# Altium schematic sheet DDR3_Termination.SchDoc
size A3
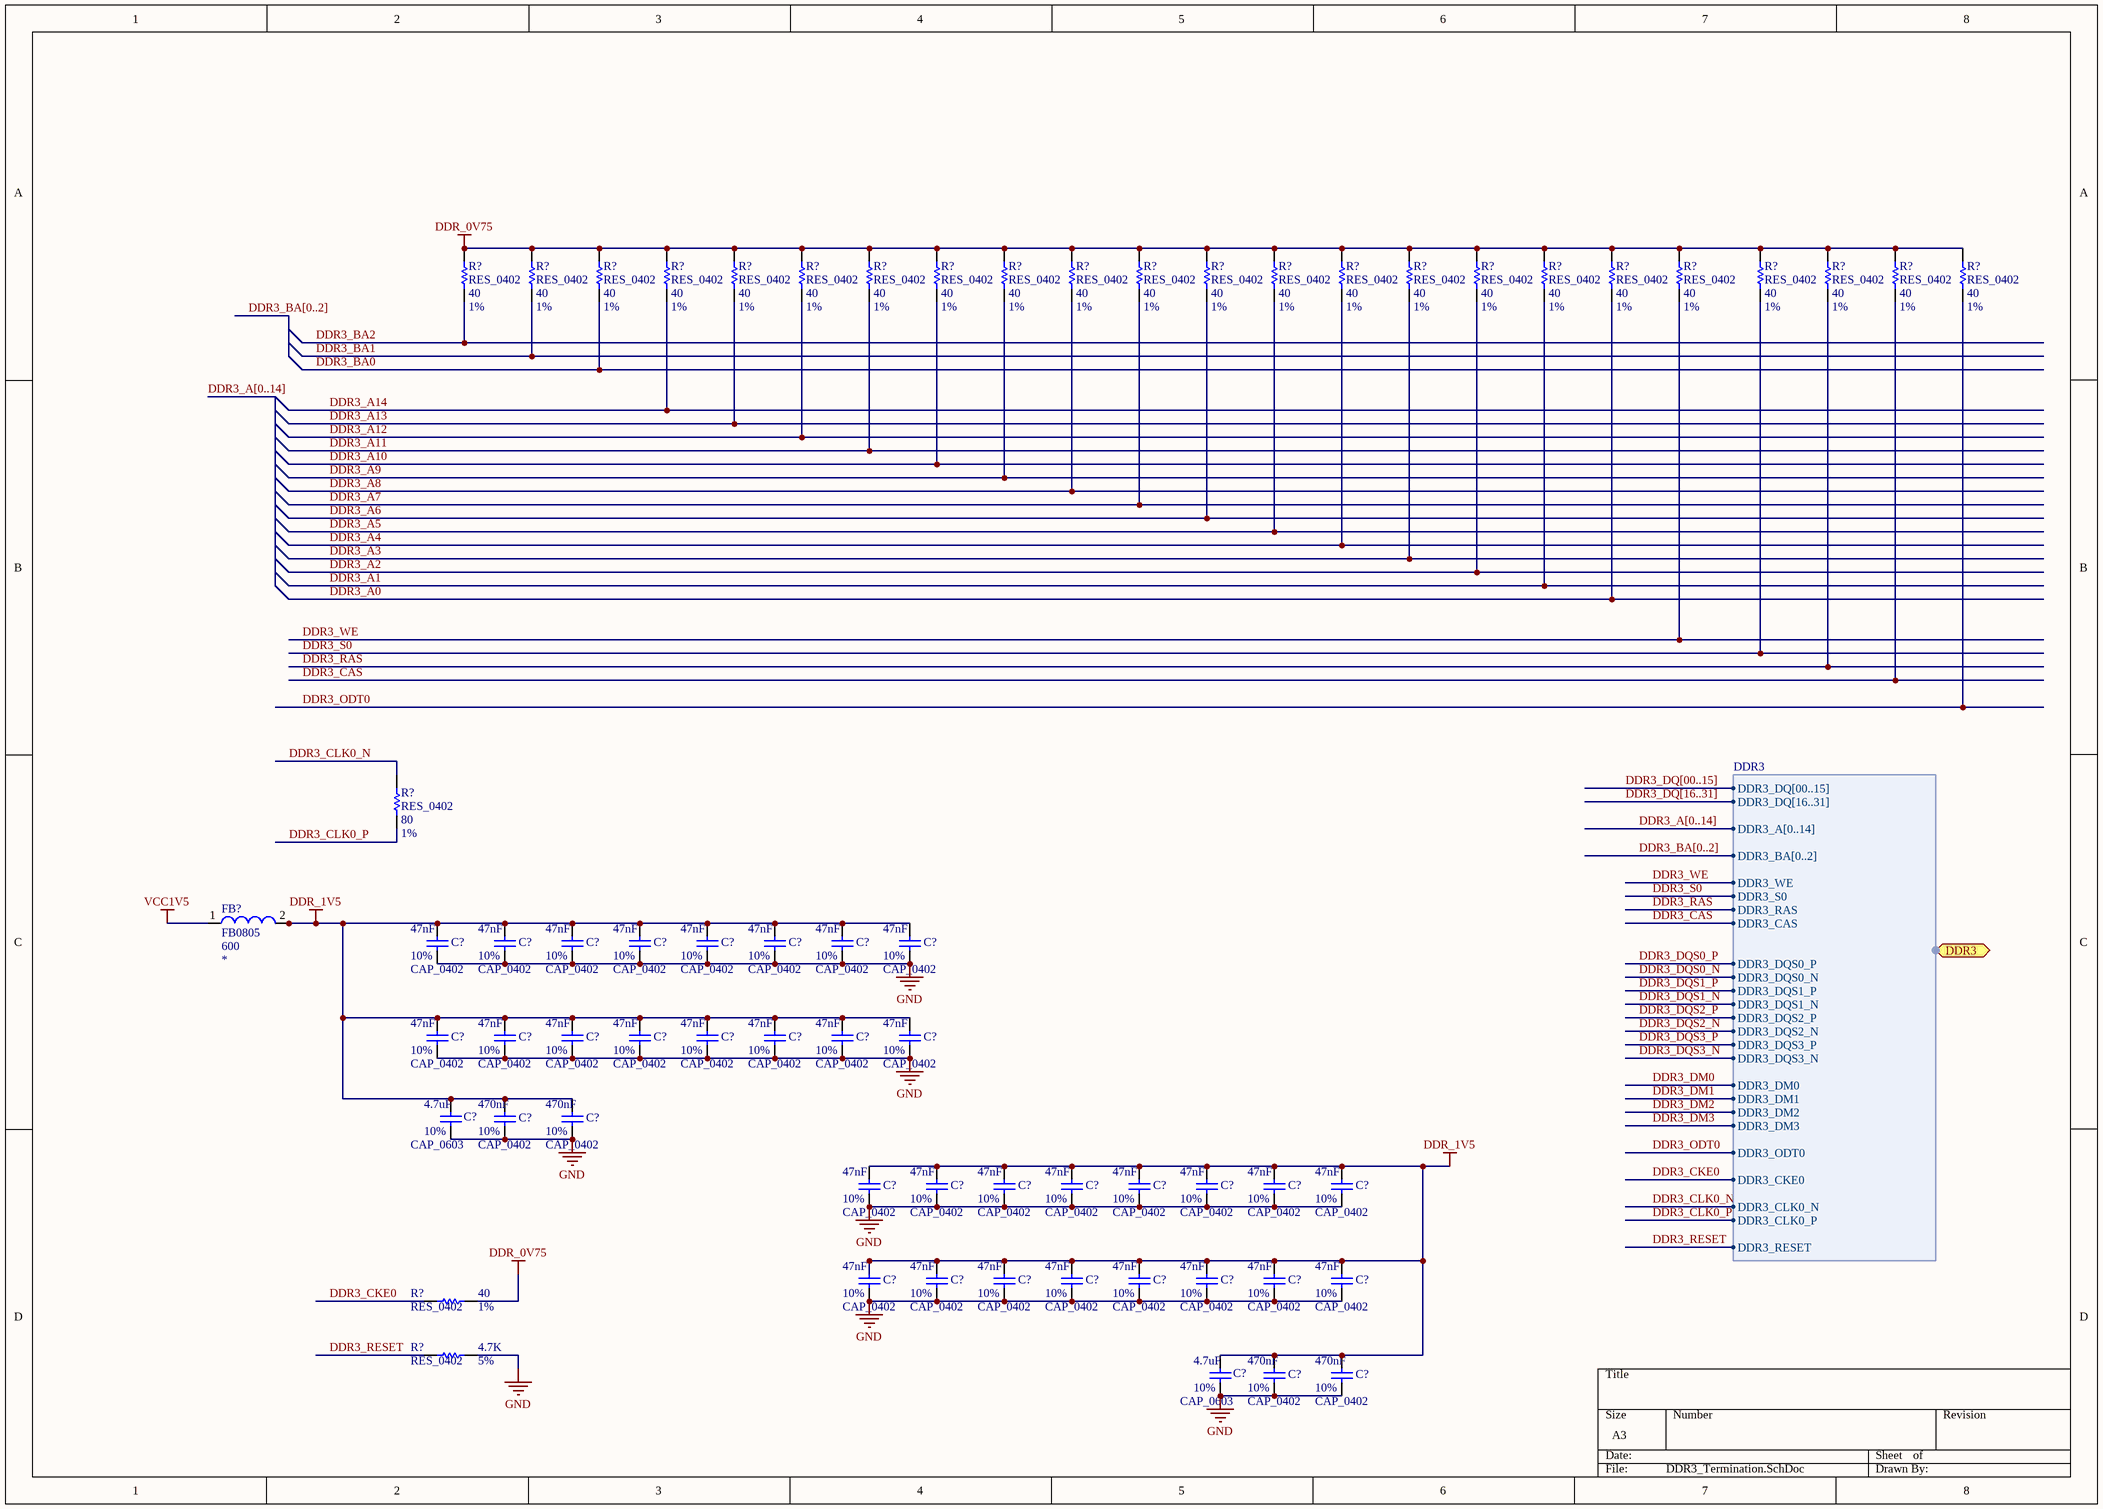
[diagram p0: DDR3_Termination.SchDoc]

## Parts
(Parts that share a designator on the sheet are numbered #1, #2 ... from top to bottom, then left to right.)
C?#1  CAP_0402  value 47nF  Tolerance: 10%  [CAPC0402(1005)60_N]
C?#2  CAP_0402  value 47nF  Tolerance: 10%  [CAPC0402(1005)60_N]
C?#3  CAP_0402  value 47nF  Tolerance: 10%  [CAPC0402(1005)60_N]
C?#4  CAP_0402  value 47nF  Tolerance: 10%  [CAPC0402(1005)60_N]
C?#5  CAP_0402  value 47nF  Tolerance: 10%  [CAPC0402(1005)60_N]
C?#6  CAP_0402  value 47nF  Tolerance: 10%  [CAPC0402(1005)60_N]
C?#7  CAP_0402  value 47nF  Tolerance: 10%  [CAPC0402(1005)60_N]
C?#8  CAP_0402  value 47nF  Tolerance: 10%  [CAPC0402(1005)60_N]
C?#9  CAP_0402  value 47nF  Tolerance: 10%  [CAPC0402(1005)60_N]
C?#10  CAP_0402  value 47nF  Tolerance: 10%  [CAPC0402(1005)60_N]
C?#11  CAP_0402  value 47nF  Tolerance: 10%  [CAPC0402(1005)60_N]
C?#12  CAP_0402  value 47nF  Tolerance: 10%  [CAPC0402(1005)60_N]
C?#13  CAP_0402  value 47nF  Tolerance: 10%  [CAPC0402(1005)60_N]
C?#14  CAP_0402  value 47nF  Tolerance: 10%  [CAPC0402(1005)60_N]
C?#15  CAP_0402  value 47nF  Tolerance: 10%  [CAPC0402(1005)60_N]
C?#16  CAP_0402  value 47nF  Tolerance: 10%  [CAPC0402(1005)60_N]
C?#17  CAP_0603  value 4.7uF  Tolerance: 10%  [CAPC0603(1608)100_N]
C?#18  CAP_0402  value 470nF  Tolerance: 10%  [CAPC0402(1005)60_N]
C?#19  CAP_0402  value 470nF  Tolerance: 10%  [CAPC0402(1005)60_N]
C?#20  CAP_0402  value 47nF  Tolerance: 10%  [CAPC0402(1005)60_N]
C?#21  CAP_0402  value 47nF  Tolerance: 10%  [CAPC0402(1005)60_N]
C?#22  CAP_0402  value 47nF  Tolerance: 10%  [CAPC0402(1005)60_N]
C?#23  CAP_0402  value 47nF  Tolerance: 10%  [CAPC0402(1005)60_N]
C?#24  CAP_0402  value 47nF  Tolerance: 10%  [CAPC0402(1005)60_N]
C?#25  CAP_0402  value 47nF  Tolerance: 10%  [CAPC0402(1005)60_N]
C?#26  CAP_0402  value 47nF  Tolerance: 10%  [CAPC0402(1005)60_N]
C?#27  CAP_0402  value 47nF  Tolerance: 10%  [CAPC0402(1005)60_N]
C?#28  CAP_0402  value 47nF  Tolerance: 10%  [CAPC0402(1005)60_N]
C?#29  CAP_0402  value 47nF  Tolerance: 10%  [CAPC0402(1005)60_N]
C?#30  CAP_0402  value 47nF  Tolerance: 10%  [CAPC0402(1005)60_N]
C?#31  CAP_0402  value 47nF  Tolerance: 10%  [CAPC0402(1005)60_N]
C?#32  CAP_0402  value 47nF  Tolerance: 10%  [CAPC0402(1005)60_N]
C?#33  CAP_0402  value 47nF  Tolerance: 10%  [CAPC0402(1005)60_N]
C?#34  CAP_0402  value 47nF  Tolerance: 10%  [CAPC0402(1005)60_N]
C?#35  CAP_0402  value 47nF  Tolerance: 10%  [CAPC0402(1005)60_N]
C?#36  CAP_0603  value 4.7uF  Tolerance: 10%  [CAPC0603(1608)100_N]
C?#37  CAP_0402  value 470nF  Tolerance: 10%  [CAPC0402(1005)60_N]
C?#38  CAP_0402  value 470nF  Tolerance: 10%  [CAPC0402(1005)60_N]
FB?  FB0805  Resistance: 600  [FerriteBead0805_WurthElectronik]
R?#1  RES_0402  value 40  Tolerance: 1%  [RESC0402(1005)_N]
R?#2  RES_0402  value 40  Tolerance: 1%  [RESC0402(1005)_N]
R?#3  RES_0402  value 40  Tolerance: 1%  [RESC0402(1005)_N]
R?#4  RES_0402  value 40  Tolerance: 1%  [RESC0402(1005)_N]
R?#5  RES_0402  value 40  Tolerance: 1%  [RESC0402(1005)_N]
R?#6  RES_0402  value 40  Tolerance: 1%  [RESC0402(1005)_N]
R?#7  RES_0402  value 40  Tolerance: 1%  [RESC0402(1005)_N]
R?#8  RES_0402  value 40  Tolerance: 1%  [RESC0402(1005)_N]
R?#9  RES_0402  value 40  Tolerance: 1%  [RESC0402(1005)_N]
R?#10  RES_0402  value 40  Tolerance: 1%  [RESC0402(1005)_N]
R?#11  RES_0402  value 40  Tolerance: 1%  [RESC0402(1005)_N]
R?#12  RES_0402  value 40  Tolerance: 1%  [RESC0402(1005)_N]
R?#13  RES_0402  value 40  Tolerance: 1%  [RESC0402(1005)_N]
R?#14  RES_0402  value 40  Tolerance: 1%  [RESC0402(1005)_N]
R?#15  RES_0402  value 40  Tolerance: 1%  [RESC0402(1005)_N]
R?#16  RES_0402  value 40  Tolerance: 1%  [RESC0402(1005)_N]
R?#17  RES_0402  value 40  Tolerance: 1%  [RESC0402(1005)_N]
R?#18  RES_0402  value 40  Tolerance: 1%  [RESC0402(1005)_N]
R?#19  RES_0402  value 40  Tolerance: 1%  [RESC0402(1005)_N]
R?#20  RES_0402  value 40  Tolerance: 1%  [RESC0402(1005)_N]
R?#21  RES_0402  value 40  Tolerance: 1%  [RESC0402(1005)_N]
R?#22  RES_0402  value 40  Tolerance: 1%  [RESC0402(1005)_N]
R?#23  RES_0402  value 40  Tolerance: 1%  [RESC0402(1005)_N]
R?#24  RES_0402  value 80  Tolerance: 1%  [RESC0402(1005)_N]
R?#25  RES_0402  value 40  Tolerance: 1%  [RESC0402(1005)_N]
R?#26  RES_0402  value 4.7K  Tolerance: 5%  [RESC0402(1005)_N]

## Ports
DDR3 (harness DDR3)

## Harnesses
DDR3: DDR3_DQ[00..15], DDR3_DQ[16..31], DDR3_A[0..14], DDR3_BA[0..2], DDR3_WE, DDR3_S0, DDR3_RAS, DDR3_CAS, DDR3_DQS0_P, DDR3_DQS0_N, DDR3_DQS1_P, DDR3_DQS1_N, DDR3_DQS2_P, DDR3_DQS2_N, DDR3_DQS3_P, DDR3_DQS3_N, DDR3_DM0, DDR3_DM1, DDR3_DM2, DDR3_DM3, DDR3_ODT0, DDR3_CKE0, DDR3_CLK0_N, DDR3_CLK0_P, DDR3_RESET

## Nets
DDR_0V75: R?#1.2 R?#2.2 R?#3.2 R?#4.2 R?#5.2 R?#6.2 R?#7.2 R?#8.2 R?#9.2 R?#10.2 R?#11.2 R?#12.2 R?#13.2 R?#14.2 R?#15.2 R?#16.2 R?#17.2 R?#18.2 R?#19.2 R?#20.2 R?#21.2 R?#22.2 R?#23.2 R?#25.2
DDR_1V5: C?#1.2 C?#2.2 C?#3.2 C?#4.2 C?#5.2 C?#6.2 C?#7.2 C?#8.2 C?#9.2 C?#10.2 C?#11.2 C?#12.2 C?#13.2 C?#14.2 C?#15.2 C?#16.2 C?#17.2 C?#18.2 C?#19.2 C?#20.2 C?#21.2 C?#22.2 C?#23.2 C?#24.2 C?#25.2 C?#26.2 C?#27.2 C?#28.2 C?#29.2 C?#30.2 C?#31.2 C?#32.2 C?#33.2 C?#34.2 C?#35.2 C?#36.2 C?#37.2 C?#38.2 FB?.2
GND: C?#1.1 C?#2.1 C?#3.1 C?#4.1 C?#5.1 C?#6.1 C?#7.1 C?#8.1 C?#9.1 C?#10.1 C?#11.1 C?#12.1 C?#13.1 C?#14.1 C?#15.1 C?#16.1 C?#17.1 C?#18.1 C?#19.1 C?#20.1 C?#21.1 C?#22.1 C?#23.1 C?#24.1 C?#25.1 C?#26.1 C?#27.1 C?#28.1 C?#29.1 C?#30.1 C?#31.1 C?#32.1 C?#33.1 C?#34.1 C?#35.1 C?#36.1 C?#37.1 C?#38.1 R?#26.2
VCC1V5: FB?.1
DDR3_A0: R?#18.1
DDR3_A1: R?#17.1
DDR3_A2: R?#16.1
DDR3_A3: R?#15.1
DDR3_A4: R?#14.1
DDR3_A5: R?#13.1
DDR3_A6: R?#12.1
DDR3_A7: R?#11.1
DDR3_A8: R?#10.1
DDR3_A9: R?#9.1
DDR3_A10: R?#8.1
DDR3_A11: R?#7.1
DDR3_A12: R?#6.1
DDR3_A13: R?#5.1
DDR3_A14: R?#4.1
DDR3_BA0: R?#3.1
DDR3_BA1: R?#2.1
DDR3_BA2: R?#1.1
DDR3_CAS: R?#22.1 ; port DDR3.DDR3_CAS
DDR3_CKE0: R?#25.1 ; port DDR3.DDR3_CKE0
DDR3_CLK0_N: R?#24.2 ; port DDR3.DDR3_CLK0_N
DDR3_CLK0_P: R?#24.1 ; port DDR3.DDR3_CLK0_P
DDR3_DM0: port DDR3.DDR3_DM0
DDR3_DM1: port DDR3.DDR3_DM1
DDR3_DM2: port DDR3.DDR3_DM2
DDR3_DM3: port DDR3.DDR3_DM3
DDR3_DQS0_N: port DDR3.DDR3_DQS0_N
DDR3_DQS0_P: port DDR3.DDR3_DQS0_P
DDR3_DQS1_N: port DDR3.DDR3_DQS1_N
DDR3_DQS1_P: port DDR3.DDR3_DQS1_P
DDR3_DQS2_N: port DDR3.DDR3_DQS2_N
DDR3_DQS2_P: port DDR3.DDR3_DQS2_P
DDR3_DQS3_N: port DDR3.DDR3_DQS3_N
DDR3_DQS3_P: port DDR3.DDR3_DQS3_P
DDR3_ODT0: R?#23.1 ; port DDR3.DDR3_ODT0
DDR3_RAS: R?#21.1 ; port DDR3.DDR3_RAS
DDR3_RESET: R?#26.1 ; port DDR3.DDR3_RESET
DDR3_S0: R?#20.1 ; port DDR3.DDR3_S0
DDR3_WE: R?#19.1 ; port DDR3.DDR3_WE

## Buses and harness runs
bus DDR3_A[0..14]
bus DDR3_BA[0..2]
bus DDR3_DQ[00..15]
bus DDR3_DQ[16..31]

## Library data of the parts
FB? = FerriteBead0805: Ferrite Bead 0805; Max_Current: *